# EAGLE design DW08B (EAGLE 6.6.0)
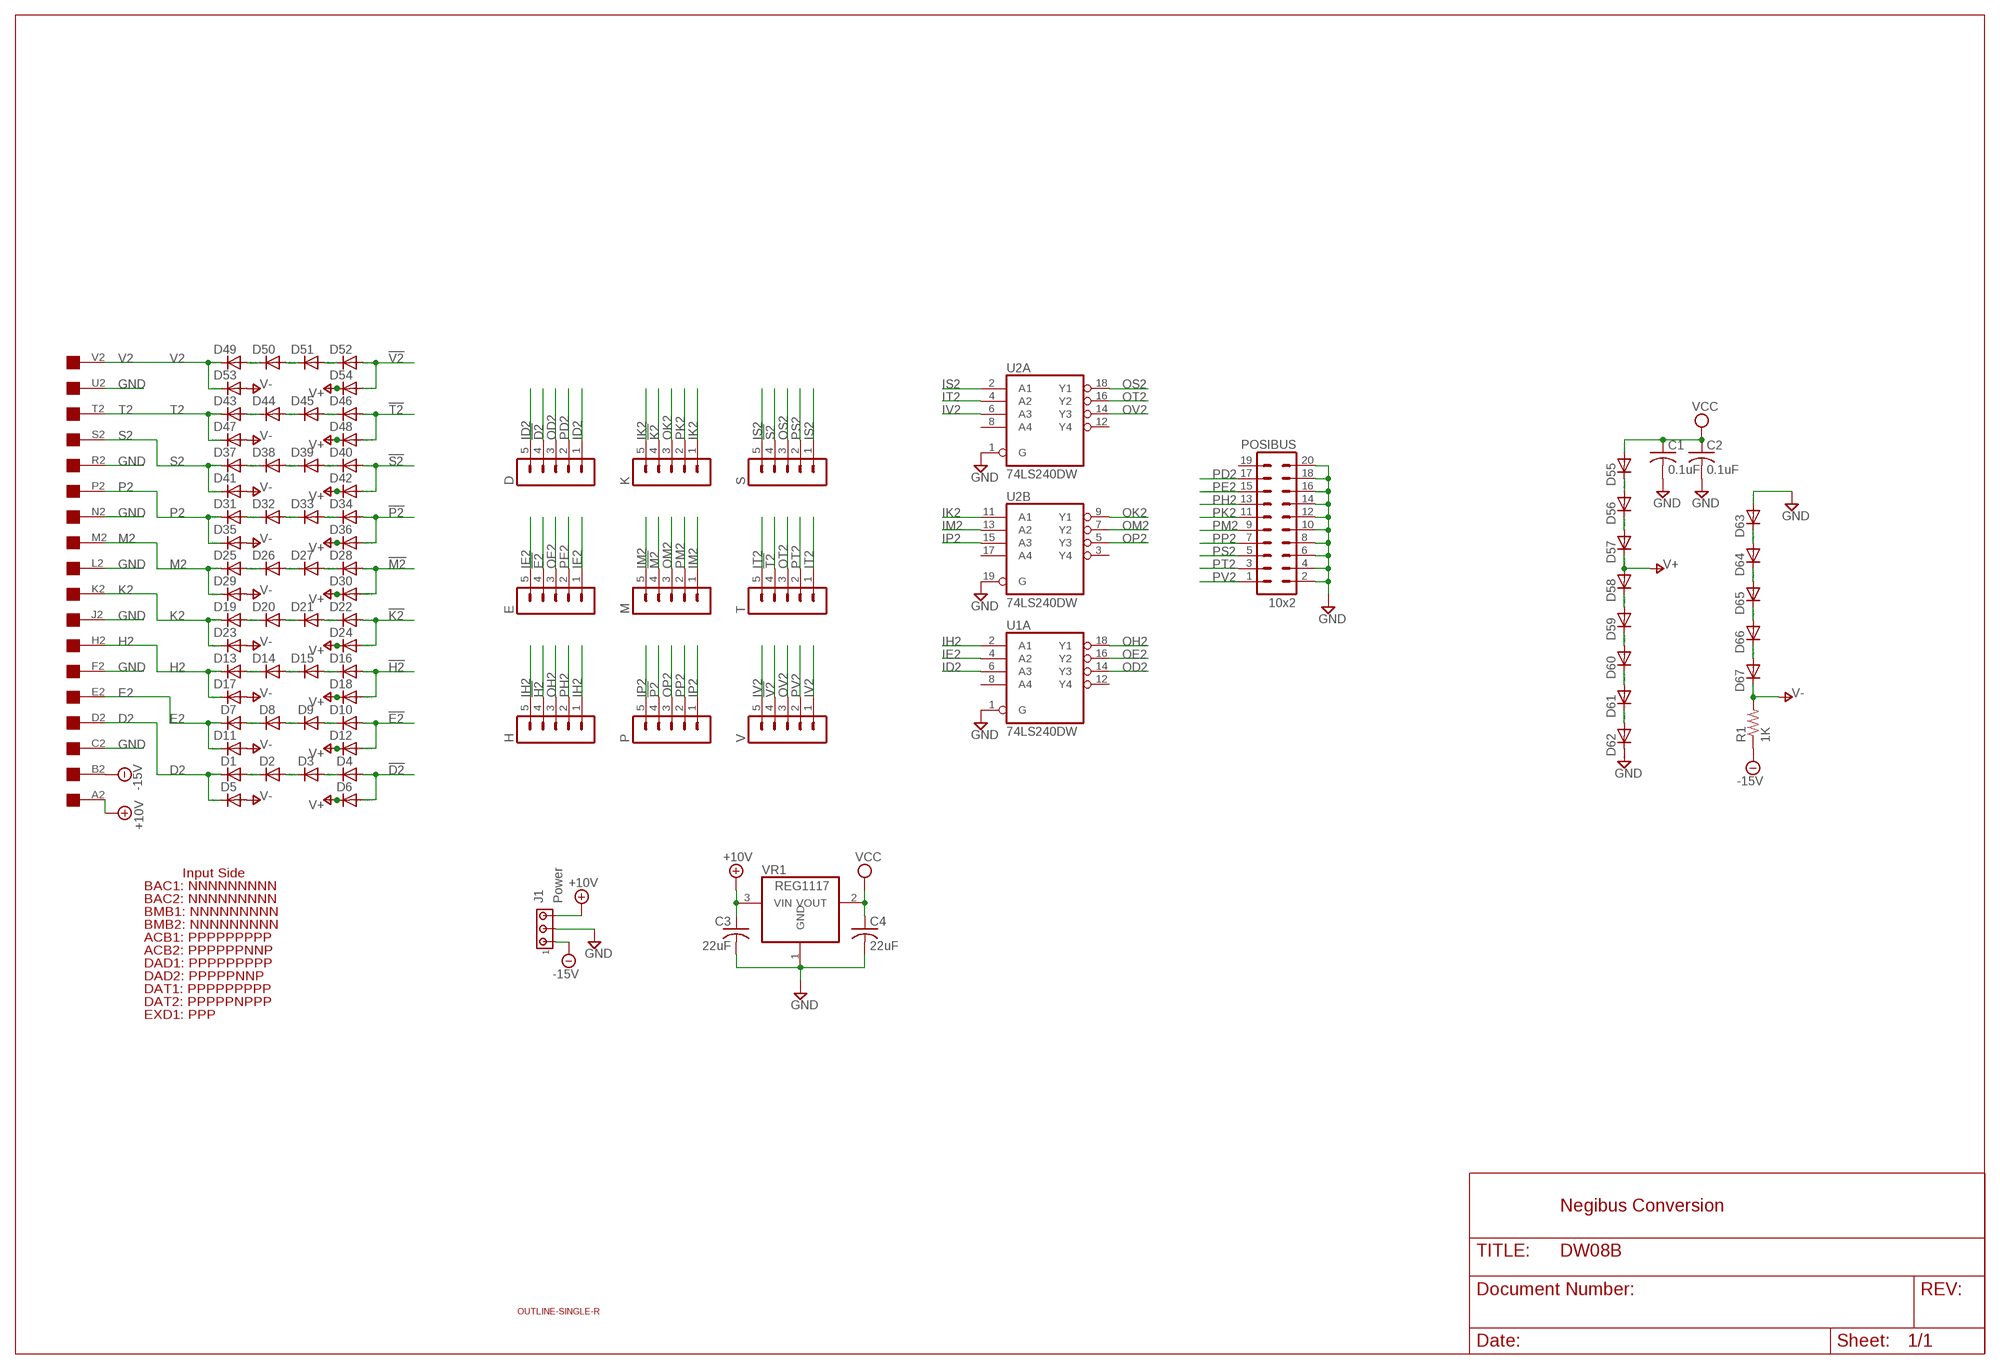
[diagram p0: schematic, sheet 1]

## Parts
C1  0.1uF  C-US050-025X075  [C050-025X075]
C2  0.1uF  C-US050-025X075  [C050-025X075]
C3  22uF  C-USC0805  [C0805]
C4  22uF  C-USC0805  [C0805]
D  MA05-1  [MA05-1]
D1  1N4148WS  DIODE-SOD323-W  [SOD323-W]
D2  1N4148WS  DIODE-SOD323-W  [SOD323-W]
D3  1N4148WS  DIODE-SOD323-W  [SOD323-W]
D4  1N4148WS  DIODE-SOD323-W  [SOD323-W]
D5  1N4148WS  DIODE-SOD323-W  [SOD323-W]
D6  1N4148WS  DIODE-SOD323-W  [SOD323-W]
D7  1N4148WS  DIODE-SOD323-W  [SOD323-W]
D8  1N4148WS  DIODE-SOD323-W  [SOD323-W]
D9  1N4148WS  DIODE-SOD323-W  [SOD323-W]
D10  1N4148WS  DIODE-SOD323-W  [SOD323-W]
D11  1N4148WS  DIODE-SOD323-W  [SOD323-W]
D12  1N4148WS  DIODE-SOD323-W  [SOD323-W]
D13  1N4148WS  DIODE-SOD323-W  [SOD323-W]
D14  1N4148WS  DIODE-SOD323-W  [SOD323-W]
D15  1N4148WS  DIODE-SOD323-W  [SOD323-W]
D16  1N4148WS  DIODE-SOD323-W  [SOD323-W]
D17  1N4148WS  DIODE-SOD323-W  [SOD323-W]
D18  1N4148WS  DIODE-SOD323-W  [SOD323-W]
D19  1N4148WS  DIODE-SOD323-W  [SOD323-W]
D20  1N4148WS  DIODE-SOD323-W  [SOD323-W]
D21  1N4148WS  DIODE-SOD323-W  [SOD323-W]
D22  1N4148WS  DIODE-SOD323-W  [SOD323-W]
D23  1N4148WS  DIODE-SOD323-W  [SOD323-W]
D24  1N4148WS  DIODE-SOD323-W  [SOD323-W]
D25  1N4148WS  DIODE-SOD323-W  [SOD323-W]
D26  1N4148WS  DIODE-SOD323-W  [SOD323-W]
D27  1N4148WS  DIODE-SOD323-W  [SOD323-W]
D28  1N4148WS  DIODE-SOD323-W  [SOD323-W]
D29  1N4148WS  DIODE-SOD323-W  [SOD323-W]
D30  1N4148WS  DIODE-SOD323-W  [SOD323-W]
D31  1N4148WS  DIODE-SOD323-W  [SOD323-W]
D32  1N4148WS  DIODE-SOD323-W  [SOD323-W]
D33  1N4148WS  DIODE-SOD323-W  [SOD323-W]
D34  1N4148WS  DIODE-SOD323-W  [SOD323-W]
D35  1N4148WS  DIODE-SOD323-W  [SOD323-W]
D36  1N4148WS  DIODE-SOD323-W  [SOD323-W]
D37  1N4148WS  DIODE-SOD323-W  [SOD323-W]
D38  1N4148WS  DIODE-SOD323-W  [SOD323-W]
D39  1N4148WS  DIODE-SOD323-W  [SOD323-W]
D40  1N4148WS  DIODE-SOD323-W  [SOD323-W]
D41  1N4148WS  DIODE-SOD323-W  [SOD323-W]
D42  1N4148WS  DIODE-SOD323-W  [SOD323-W]
D43  1N4148WS  DIODE-SOD323-W  [SOD323-W]
D44  1N4148WS  DIODE-SOD323-W  [SOD323-W]
D45  1N4148WS  DIODE-SOD323-W  [SOD323-W]
D46  1N4148WS  DIODE-SOD323-W  [SOD323-W]
D47  1N4148WS  DIODE-SOD323-W  [SOD323-W]
D48  1N4148WS  DIODE-SOD323-W  [SOD323-W]
D49  1N4148WS  DIODE-SOD323-W  [SOD323-W]
D50  1N4148WS  DIODE-SOD323-W  [SOD323-W]
D51  1N4148WS  DIODE-SOD323-W  [SOD323-W]
D52  1N4148WS  DIODE-SOD323-W  [SOD323-W]
D53  1N4148WS  DIODE-SOD323-W  [SOD323-W]
D54  1N4148WS  DIODE-SOD323-W  [SOD323-W]
D55  1N4148WS  DIODE-SOD323-W  [SOD323-W]
D56  1N4148WS  DIODE-SOD323-W  [SOD323-W]
D57  1N4148WS  DIODE-SOD323-W  [SOD323-W]
D58  1N4148WS  DIODE-SOD323-W  [SOD323-W]
D59  1N4148WS  DIODE-SOD323-W  [SOD323-W]
D60  1N4148WS  DIODE-SOD323-W  [SOD323-W]
D61  1N4148WS  DIODE-SOD323-W  [SOD323-W]
D62  1N4148WS  DIODE-SOD323-W  [SOD323-W]
D63  1N4148WS  DIODE-SOD323-W  [SOD323-W]
D64  1N4148WS  DIODE-SOD323-W  [SOD323-W]
D65  1N4148WS  DIODE-SOD323-W  [SOD323-W]
D66  1N4148WS  DIODE-SOD323-W  [SOD323-W]
D67  1N4148WS  DIODE-SOD323-W  [SOD323-W]
E  MA05-1  [MA05-1]
H  MA05-1  [MA05-1]
J1  Power  MTA03-100  [10X03MTA]
K  MA05-1  [MA05-1]
M  MA05-1  [MA05-1]
P  MA05-1  [MA05-1]
POSIBUS  10x2  MA10-2  [MA10-2]
R1  1K  R-US_0207/10  [0207/10]
S  MA05-1  [MA05-1]
T  MA05-1  [MA05-1]
U1  74LS240DW  [SO20W]
U2  74LS240DW  [SO20W]
U$1  OUTLINE-SINGLE-R  [SINGLE-R]
U$2  EDGE  SINGLE  [EDGE-CON2]
V  MA05-1  [MA05-1]
VR1  REG1117  [SOT223]

## Nets
!D2: D4.A D6.A D.4
!E2: D10.A D12.A E.4
!H2: D16.A D18.A H.4
!K2: D22.A D24.A K.4
!M2: D28.A D30.A M.4
!P2: D34.A D36.A P.4
!S2: D40.A D42.A S.4
!T2: D46.A D48.A T.4
!V2: D52.A D54.A V.4
+10V: C3.1 J1.3 U$2.A2 VR1.3(VIN)
-15V: J1.1 R1.1 U$2.B2
D2: D1.C D5.C U$2.D2
E2: D7.C D11.C U$2.E2
GND [Ground]: C1.2 C2.2 C3.2 C4.2 D62.C D63.A J1.2 POSIBUS.2 POSIBUS.4 POSIBUS.6 POSIBUS.8 POSIBUS.10 POSIBUS.12 POSIBUS.14 POSIBUS.16 POSIBUS.18 POSIBUS.20 U1.1(A:G) U2.1(A:G) U2.19(B:G) U$2.C2 U$2.F2 U$2.J2 U$2.L2 U$2.N2 U$2.R2 U$2.U2 VR1.1(GND)
H2: D13.C D17.C U$2.H2
ID2: D.1 D.5 U1.6(A:A3)
IE2: E.1 E.5 U1.4(A:A2)
IH2: H.1 H.5 U1.2(A:A1)
IK2: K.1 K.5 U2.11(B:A1)
IM2: M.1 M.5 U2.13(B:A2)
IP2: P.1 P.5 U2.15(B:A3)
IS2: S.1 S.5 U2.2(A:A1)
IT2: T.1 T.5 U2.4(A:A2)
IV2: U2.6(A:A3) V.1 V.5
K2: D19.C D23.C U$2.K2
M2: D25.C D29.C U$2.M2
N$1: D13.A D14.C
N$2: D1.A D2.C
N$3: D2.A D3.C
N$4: D3.A D4.C
N$5: D14.A D15.C
N$6: D15.A D16.C
N$7: D7.A D8.C
N$8: D8.A D9.C
N$9: D9.A D10.C
N$10: D19.A D20.C
N$11: D20.A D21.C
N$12: D21.A D22.C
N$13: D25.A D26.C
N$14: D26.A D27.C
N$15: D27.A D28.C
N$16: D31.A D32.C
N$17: D32.A D33.C
N$18: D33.A D34.C
N$19: D37.A D38.C
N$20: D38.A D39.C
N$21: D39.A D40.C
N$22: D43.A D44.C
N$23: D44.A D45.C
N$24: D45.A D46.C
N$25: D49.A D50.C
N$26: D50.A D51.C
N$27: D51.A D52.C
N$28: D55.C D56.A
N$29: D56.C D57.A
N$30: D65.C D66.A
N$31: D58.C D59.A
N$32: D59.C D60.A
N$33: D60.C D61.A
N$34: D63.C D64.A
N$35: D64.C D65.A
N$36 [Ground]: D61.C D62.A
N$37: D66.C D67.A
OD2: D.3 U1.14(A:Y3)
OE2: E.3 U1.16(A:Y2)
OH2: H.3 U1.18(A:Y1)
OK2: K.3 U2.9(B:Y1)
OM2: M.3 U2.7(B:Y2)
OP2: P.3 U2.5(B:Y3)
OS2: S.3 U2.18(A:Y1)
OT2: T.3 U2.16(A:Y2)
OV2: U2.14(A:Y3) V.3
P2: D31.C D35.C U$2.P2
PD2: D.2 POSIBUS.17
PE2: E.2 POSIBUS.15
PH2: H.2 POSIBUS.13
PK2: K.2 POSIBUS.11
PM2: M.2 POSIBUS.9
PP2: P.2 POSIBUS.7
PS2: POSIBUS.5 S.2
PT2: POSIBUS.3 T.2
PV2: POSIBUS.1 V.2
S2: D37.C D41.C U$2.S2
T2: D43.C D47.C U$2.T2
V2: D49.C D53.C U$2.V2
V+: D6.C D12.C D18.C D24.C D30.C D36.C D42.C D48.C D54.C D57.C D58.A
V-: D5.A D11.A D17.A D23.A D29.A D35.A D41.A D47.A D53.A D67.C R1.2
VCC: C1.1 C2.1 C4.1 D55.A VR1.2(VOUT)
Unconnected: POSIBUS.19 U1.3(B:Y4) U1.5(B:Y3) U1.7(B:Y2) U1.8(A:A4) U1.9(B:Y1) U1.11(B:A1) U1.12(A:Y4) U1.13(B:A2) U1.15(B:A3) U1.17(B:A4) U1.19(B:G) U2.3(B:Y4) U2.8(A:A4) U2.12(A:Y4) U2.17(B:A4) U$2.A1 U$2.B1 U$2.C1 U$2.D1 U$2.E1 U$2.F1 U$2.H1 U$2.J1 U$2.K1 U$2.L1 U$2.M1 U$2.N1 U$2.P1 U$2.R1 U$2.S1 U$2.T1 U$2.U1 U$2.V1

## Notes on the sheet
- Input Side
- BAC1: NNNNNNNNN
- BAC2: NNNNNNNNN
- BMB1: NNNNNNNNN
- BMB2: NNNNNNNNN
- ACB1: PPPPPPPPP
- ACB2: PPPPPPNNP
- DAD1: PPPPPPPPP
- DAD2: PPPPPNNP
- DAT1: PPPPPPPPP
- DAT2: PPPPPNPPP
- EXD1: PPP
- Negibus Conversion

## Power pins joined to a net without a drawn wire
GND: U1.10(P:GND) U2.10(P:GND)
VCC: U1.20(P:VCC) U2.20(P:VCC)

## Library data of the parts
C1-C4 = rcl:C-US: CAPACITOR, American symbol
D E H K M P S T V = con-lstb:MA05-1: PIN HEADER; OC_FARNELL: unknown; OC_NEWARK: unknown
D1-D67 = diode:DIODE-: DIODE
J1 = con-amp:MTA03-100: AMP connector
POSIBUS = con-lstb:MA10-2: PIN HEADER; OC_FARNELL: unknown; OC_NEWARK: unknown
R1 = rcl:R-US_: RESISTOR, American symbol
U1 U2 = 74xx-us:74*240: Octal BUFFER and LINE DRIVER, 3-state
U$1 = dec-con:OUTLINE-*: Board outlines for DEC boards.
U$2 = dec-con:SINGLE: Single-Height DEC board
VR1 = burr-brown:REG1117: 800mA and 1A Low Dropout (LDO) Positive Regulator 1.8V, 2.5V, 2.85V, 3.3V, 5V, and Adj; MPN: REG1117; OC_FARNELL: 1097566; OC_NEWARK: 14P6981

## Board
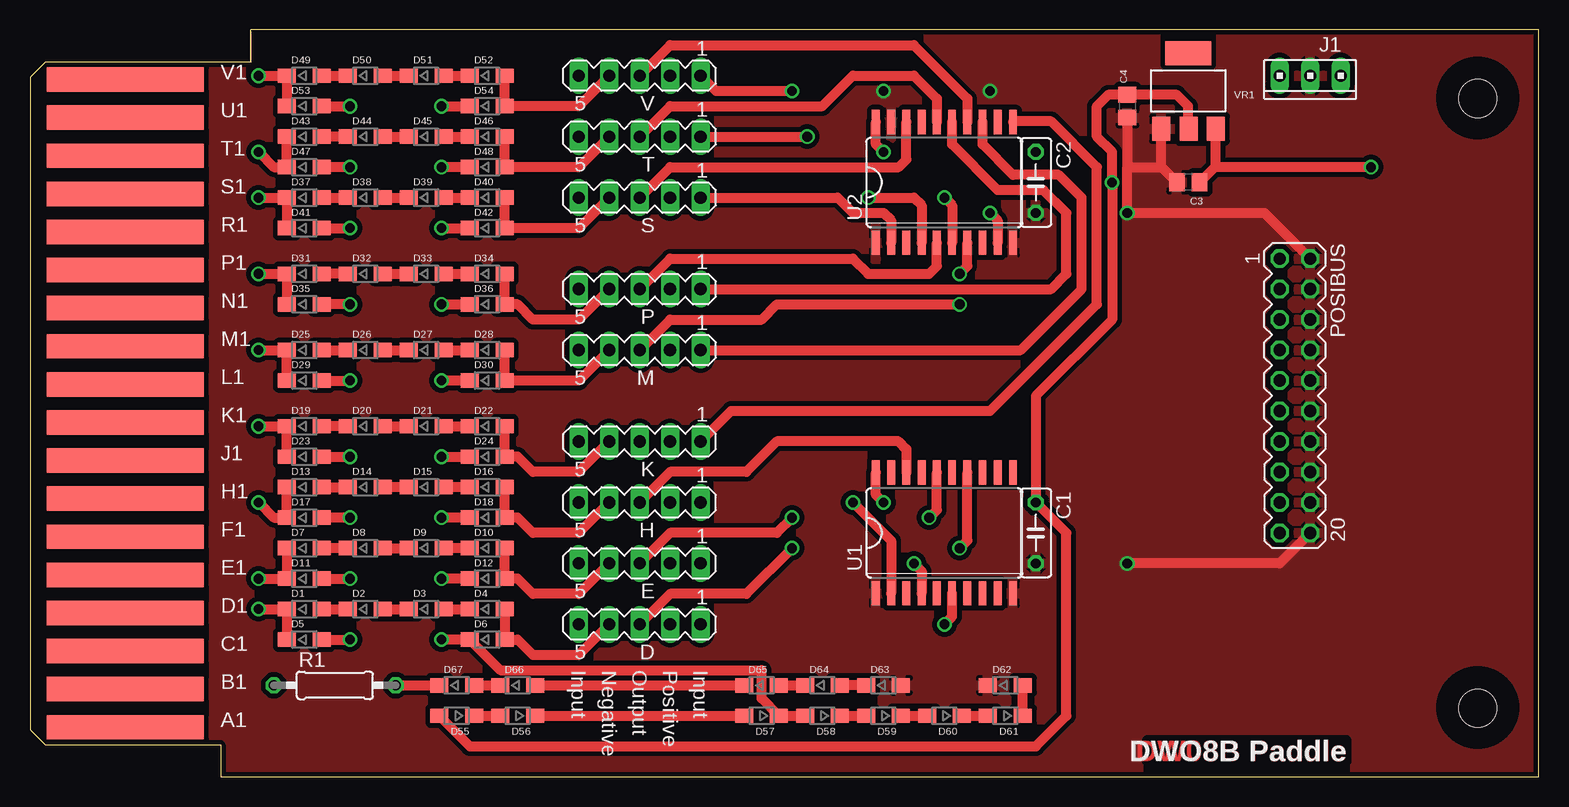
[diagram p1: board, top side]
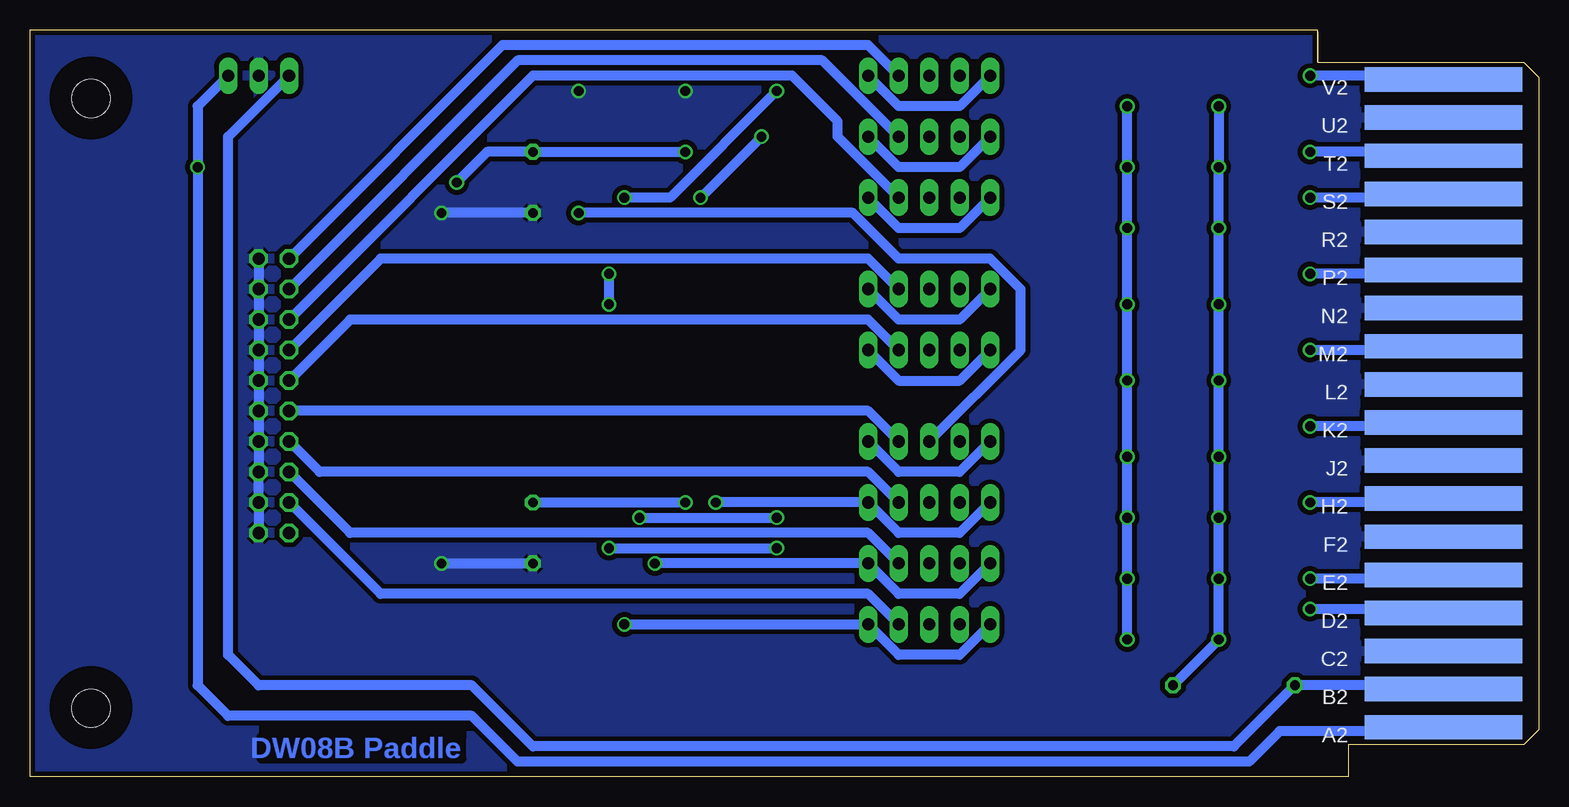
[diagram p2: board, bottom side, seen from below]

Size 125.73 x 62.23 mm. Coordinates in mm from the lower left corner, seen from the top.
Copper layers (1+16): Top 0.035mm / dielectric 1.5mm / Bottom 0.035mm
Design rules "16mils": minimum track width 16mil, minimum drill 32mil, track to track 15mil, track to pad 10mil, pad to pad 10mil, via to via 10mil, smd to smd 10mil, copper to edge 13mil, drill to drill 10mil, minimum pad ring 10mil, minimum via ring 8mil, stop-mask expansion 0mil, vias tented up to drill 0mil, thermal gap 10mil
tRestrict: area 117.8,53.7 to 123.5,59.4; area 117.8,2.9 to 123.5,8.6
bRestrict: area 117.8,53.7 to 123.5,59.4; area 117.8,2.9 to 123.5,8.6; area 117.8,53.7 to 123.5,59.4

### Footprints (pad centres in the part's own frame; a part is rotated, then mirrored left to right if it is on the bottom)
C050-025X075 = drill 0.813 octagon: 1 -2.54,0; 2 2.54,0
C0805 = smd 1.3 x 1.5: 1 -0.95,0; 2 0.95,0
MA05-1 = drill 1.016 long: 1 -5.08,0; 2 -2.54,0; 3 0,0; 4 2.54,0; 5 5.08,0
SOD323-W = smd 1.5 x 1.2: A 1.45,0; C -1.45,0
10X03MTA = drill 1.016 long: 1 2.54,0; 2 0,0; 3 -2.54,0
MA10-2 = drill 1.016 octagon: 1 -11.43,-1.27; 2 -11.43,1.27; 3 -8.89,-1.27; 4 -8.89,1.27; 5 -6.35,-1.27; 6 -6.35,1.27; 7 -3.81,-1.27; 8 -3.81,1.27; 9 -1.27,-1.27; 10 -1.27,1.27; 11 1.27,-1.27; 12 1.27,1.27; 13 3.81,-1.27; 14 3.81,1.27; 15 6.35,-1.27; 16 6.35,1.27; 17 8.89,-1.27; 18 8.89,1.27; 19 11.43,-1.27; 20 11.43,1.27
0207/10 = drill 0.813 octagon: 1 -5.08,0; 2 5.08,0
SO20W = smd 0.66 x 2.032: 1 -5.715,-5.029; 2 -4.445,-5.029; 3 -3.175,-5.029; 4 -1.905,-5.029; 5 -0.635,-5.029; 6 0.635,-5.029; 7 1.905,-5.029; 8 3.175,-5.029; 9 4.445,-5.029; 10 5.715,-5.029; 11 5.715,5.029; 12 4.445,5.029; 13 3.175,5.029; 14 1.905,5.029; 15 0.635,5.029; 16 -0.635,5.029; 17 -1.905,5.029; 18 -3.175,5.029; 19 -4.445,5.029; 20 -5.715,5.029
SINGLE-R = hole 3.175: 5.08,5.715; 5.08,56.515
EDGE-CON2 = smd 13.106 x 2.032: A1 7.938,4.128; B1 7.938,7.303; C1 7.938,10.477; D1 7.938,13.652; E1 7.938,16.828; F1 7.938,20.003; H1 7.938,23.177; J1 7.938,26.352; K1 7.938,29.527; L1 7.938,32.703; M1 7.938,35.877; N1 7.938,39.053; P1 7.938,42.227; R1 7.938,45.403; S1 7.938,48.578; T1 7.938,51.752; U1 7.938,54.928; V1 7.938,58.102 | smd 13.106 x 2.032 bottom: A2 7.938,4.128; B2 7.938,7.303; C2 7.938,10.477; D2 7.938,13.652; E2 7.938,16.828; F2 7.938,20.003; H2 7.938,23.177; J2 7.938,26.352; K2 7.938,29.527; L2 7.938,32.703; M2 7.938,35.877; N2 7.938,39.053; P2 7.938,42.227; R2 7.938,45.403; S2 7.938,48.578; T2 7.938,51.752; U2 7.938,54.928; V2 7.938,58.102
SOT223 = smd 1.499 x 2.007: 1 -2.261,-3.15; 2 0.025,-3.15; 3 2.311,-3.15 | smd 3.81 x 2.007: 4 0,3.15

### Placement (x,y rotation side)
C1  83.82,20.32 270 top
C2  83.82,49.53 270 top
C3  96.52,49.53 180 top
C4  91.44,55.88 270 top
D  50.8,12.7 180 top
D1  22.86,13.97 0 top
D2  27.94,13.97 0 top
D3  33.02,13.97 0 top
D4  38.1,13.97 0 top
D5  22.86,11.43 0 top
D6  38.1,11.43 0 top
D7  22.86,19.05 0 top
D8  27.94,19.05 0 top
D9  33.02,19.05 0 top
D10  38.1,19.05 0 top
D11  22.86,16.51 0 top
D12  38.1,16.51 0 top
D13  22.86,24.13 0 top
D14  27.94,24.13 0 top
D15  33.02,24.13 0 top
D16  38.1,24.13 0 top
D17  22.86,21.59 0 top
D18  38.1,21.59 0 top
D19  22.86,29.21 0 top
D20  27.94,29.21 0 top
D21  33.02,29.21 0 top
D22  38.1,29.21 0 top
D23  22.86,26.67 0 top
D24  38.1,26.67 0 top
D25  22.86,35.56 0 top
D26  27.94,35.56 0 top
D27  33.02,35.56 0 top
D28  38.1,35.56 0 top
D29  22.86,33.02 0 top
D30  38.1,33.02 0 top
D31  22.86,41.91 0 top
D32  27.94,41.91 0 top
D33  33.02,41.91 0 top
D34  38.1,41.91 0 top
D35  22.86,39.37 0 top
D36  38.1,39.37 0 top
D37  22.86,48.26 0 top
D38  27.94,48.26 0 top
D39  33.02,48.26 0 top
D40  38.1,48.26 0 top
D41  22.86,45.72 0 top
D42  38.1,45.72 0 top
D43  22.86,53.34 0 top
D44  27.94,53.34 0 top
D45  33.02,53.34 0 top
D46  38.1,53.34 0 top
D47  22.86,50.8 0 top
D48  38.1,50.8 0 top
D49  22.86,58.42 0 top
D50  27.94,58.42 0 top
D51  33.02,58.42 0 top
D52  38.1,58.42 0 top
D53  22.86,55.88 0 top
D54  38.1,55.88 0 top
D55  35.56,5.08 180 top
D56  40.64,5.08 180 top
D57  60.96,5.08 180 top
D58  66.04,5.08 180 top
D59  71.12,5.08 180 top
D60  76.2,5.08 180 top
D61  81.28,5.08 180 top
D62  81.28,7.62 0 top
D63  71.12,7.62 0 top
D64  66.04,7.62 0 top
D65  60.96,7.62 0 top
D66  40.64,7.62 0 top
D67  35.56,7.62 0 top
E  50.8,17.78 180 top
H  50.8,22.86 180 top
J1  106.68,58.42 180 top
K  50.8,27.94 180 top
M  50.8,35.56 180 top
P  50.8,40.64 180 top
POSIBUS  105.41,31.75 270 top
R1  25.4,7.62 0 top
S  50.8,48.26 180 top
T  50.8,53.34 180 top
U1  76.2,20.32 0 top
U2  76.2,49.53 0 top
U$1  125.73,62.23 180 top
U$2  0,0 0 top
V  50.8,58.42 180 top
VR1  96.52,57.15 0 top

### Tracks (layer width: path | path; a pad name or v marks a point on that pad's centre or on a via)
!D2
  Top 0.813: D4.A D6.A 40.64,11.43 41.91,10.16 45.72,10.16 D.4
!E2
  Top 0.813: D10.A D12.A 40.64,16.51 41.91,15.24 45.72,15.24 E.4
!H2
  Top 0.813: D16.A D18.A 40.64,21.59 41.91,20.32 45.72,20.32 H.4
!K2
  Top 0.813: D22.A D24.A 40.64,26.67 41.91,25.4 45.72,25.4 K.4
!M2
  Top 0.813: D28.A D30.A 45.72,33.02 M.4
!P2
  Top 0.813: D34.A D36.A 40.64,39.37 41.91,38.1 45.72,38.1 P.4
!S2
  Top 0.813: D40.A D42.A 45.72,45.72 S.4
!T2
  Top 0.813: D46.A D48.A 45.72,50.8 T.4
!V2
  Top 0.813: D52.A D54.A 45.72,55.88 V.4
+10V  (via drill 0.81)
  Top 0.813: C3.1 98.83,50.89 | 98.83,50.89 VR1.3 | v111.76,50.8 99.06,50.8 98.97,50.89 98.83,50.89
  Bottom 0.813: U$2.A2 8.26,3.81 21.59,3.81 24.13,1.27 85.09,1.27 88.9,5.08 109.22,5.08 111.76,7.62 v111.76,50.8 111.76,55.88 J1.3
-15V
  Bottom 0.813: U$2.B2 8.26,7.62 R1.1 25.4,2.54 83.82,2.54 88.9,7.62 106.68,7.62 109.22,10.16 109.22,53.34 J1.1
D2  (via drill 0.81)
  Top 0.813: v19.05,13.97 D1.C D5.C
  Bottom 0.813: U$2.D2 8.26,13.97 v19.05,13.97
E2  (via drill 0.81)
  Top 0.813: D7.C D11.C v19.05,16.51
  Bottom 0.813: U$2.E2 8.26,16.51 v19.05,16.51
GND  (via drill 0.81)
  Top 0.813: POSIBUS.2 102.87,46.99 v91.44,46.99 91.44,50.8 | POSIBUS.20 104.14,17.78 v91.44,17.78 | C3.2 94.26,50.84 | 94.26,50.84 VR1.1 | C4.2 91.44,50.8 | 91.44,50.8 94.22,50.8 94.26,50.84
  Bottom 0.813: POSIBUS.2 POSIBUS.4 POSIBUS.6 POSIBUS.8 POSIBUS.10 POSIBUS.12 POSIBUS.14 POSIBUS.16 POSIBUS.18 POSIBUS.20 | C2.2 v91.44,46.99 | v91.44,17.78 C1.2
  other vias: 71.12,57.15 80.01,57.15
  pour Top (isolate 0.406): 125.73,62.23 13.97,62.23 13.97,0 125.73,0
  pour Bottom (isolate 0.406): 125.73,62.23 13.97,62.23 13.97,0 125.73,0
H2  (via drill 0.81)
  Top 0.813: v19.05,22.86 20.32,21.59 D17.C D13.C
  Bottom 0.813: U$2.H2 8.26,22.86 v19.05,22.86
ID2  (via drill 0.81)
  Top 0.813: v76.2,12.7 76.84,13.34 U1.6
  Bottom 0.813: D.5 48.26,10.16 53.34,10.16 D.1 v76.2,12.7
IE2  (via drill 0.81)
  Top 0.813: v73.66,17.78 74.3,17.14 U1.4
  Bottom 0.813: E.5 48.26,15.24 53.34,15.24 E.1 v73.66,17.78
IH2  (via drill 0.81)
  Top 0.813: v68.58,22.86 71.76,19.68 U1.2
  Bottom 0.813: H.5 48.26,20.32 53.34,20.32 H.1 v68.58,22.86
IK2
  Top 0.813: K.1 58.42,30.48 80.01,30.48 88.9,39.37 88.9,50.8 85.09,54.61 81.97,54.61 U2.11
  Bottom 0.813: K.5 48.26,25.4 53.34,25.4 K.1
IM2
  Top 0.813: M.1 82.55,35.56 87.63,40.64 87.63,48.26 85.73,50.16 81.92,50.16 79.38,52.7 U2.13
  Bottom 0.813: M.1 53.34,33.02 48.26,33.02 M.5
IP2
  Top 0.813: P.1 85.09,40.64 86.36,41.91 86.36,46.99 84.46,48.9 80.65,48.9 76.84,52.7 U2.15
  Bottom 0.813: P.5 48.26,38.1 53.34,38.1 P.1
IS2
  Top 0.813: S.1 67.31,48.26 68.58,46.99 71.12,46.99 71.76,46.35 U2.2
  Bottom 0.813: S.5 48.26,45.72 53.34,45.72 S.1
IT2  (via drill 0.81)
  Top 0.813: T.1 v64.77,53.34 | v69.85,48.26 73.66,48.26 74.3,47.62 U2.4
  Bottom 0.813: T.5 48.26,50.8 53.34,50.8 T.1 | v64.77,53.34 v69.85,48.26
IV2  (via drill 0.81)
  Top 0.813: V.1 57.15,57.15 v63.5,57.15 | v76.2,48.26 76.84,47.62 U2.6
  Bottom 0.813: V.5 48.26,55.88 53.34,55.88 V.1 | v63.5,57.15 72.39,48.26 v76.2,48.26
K2  (via drill 0.81)
  Top 0.813: D23.C D19.C v19.05,29.21
  Bottom 0.813: U$2.K2 8.26,29.21 v19.05,29.21
M2  (via drill 0.81)
  Top 0.813: v19.05,35.56 D25.C D29.C
  Bottom 0.813: U$2.M2 8.26,35.56 v19.05,35.56
N$1
  Top 0.813: D13.A D14.C
N$2
  Top 0.813: D1.A D2.C
N$3
  Top 0.813: D2.A D3.C
N$4
  Top 0.813: D3.A D4.C
N$5
  Top 0.813: D15.C D14.A
N$6
  Top 0.813: D16.C D15.A
N$7
  Top 0.813: D8.C D7.A
N$8
  Top 0.813: D8.A D9.C
N$9
  Top 0.813: D10.C D9.A
N$10
  Top 0.813: D20.C D19.A
N$11
  Top 0.813: D20.A D21.C
N$12
  Top 0.813: D21.A D22.C
N$13
  Top 0.813: D25.A D26.C
N$14
  Top 0.813: D26.A D27.C
N$15
  Top 0.813: D27.A D28.C
N$16
  Top 0.813: D32.C D31.A
N$17
  Top 0.813: D32.A D33.C
N$18
  Top 0.813: D33.A D34.C
N$19
  Top 0.813: D37.A D38.C
N$20
  Top 0.813: D38.A D39.C
N$21
  Top 0.813: D39.A D40.C
N$22
  Top 0.813: D44.C D43.A
N$23
  Top 0.813: D44.A D45.C
N$24
  Top 0.813: D45.A D46.C
N$25
  Top 0.813: D49.A D50.C
N$26
  Top 0.813: D50.A D51.C
N$27
  Top 0.813: D51.A D52.C
N$28
  Top 0.813: D55.C D56.A
N$29
  Top 0.813: D56.C D57.A
N$30
  Top 0.813: D66.A D65.C
N$31
  Top 0.813: D58.C D59.A
N$32
  Top 0.813: D59.C D60.A
N$33
  Top 0.813: D60.C D61.A
N$34
  Top 0.813: D63.C D64.A
N$35
  Top 0.813: D65.A D64.C
N$36
  Top 0.813: D61.C D62.A
N$37
  Top 0.813: D67.A D66.C
OD2  (via drill 0.81)
  Top 0.813: v63.5,19.05 59.69,15.24 53.34,15.24 D.3 | v77.47,19.05 78.11,19.68 U1.14
  Bottom 0.813: v77.47,19.05 v63.5,19.05
OE2  (via drill 0.81)
  Top 0.813: v63.5,21.59 62.23,20.32 53.34,20.32 E.3 | v74.93,21.59 75.57,22.23 U1.16
  Bottom 0.813: v74.93,21.59 v63.5,21.59
OH2
  Top 0.813: H.3 53.34,25.4 59.69,25.4 62.23,27.94 72.39,27.94 73.03,27.3 U1.18
OK2  (via drill 0.81)
  Top 0.813: v80.01,46.99 80.65,46.35 U2.9
  Bottom 0.813: K.3 43.18,35.56 43.18,40.64 45.72,43.18 53.34,43.18 57.15,46.99 v80.01,46.99
OM2  (via drill 0.81)
  Top 0.813: M.3 53.34,38.1 60.96,38.1 62.23,39.37 v77.47,39.37 | v77.47,41.91 78.11,42.55 U2.7
  Bottom 0.813: v77.47,39.37 v77.47,41.91
OP2
  Top 0.813: P.3 53.34,43.18 68.58,43.18 69.85,41.91 74.93,41.91 75.57,42.55 U2.5
OS2
  Top 0.813: S.3 53.34,50.8 72.39,50.8 73.03,51.44 U2.18
OT2
  Top 0.813: T.3 53.34,55.88 66.04,55.88 68.58,58.42 73.66,58.42 75.57,56.52 U2.16
OV2
  Top 0.813: V.3 53.34,60.96 73.66,60.96 78.11,56.52 U2.14
P2  (via drill 0.81)
  Top 0.813: v19.05,41.91 D31.C D35.C
  Bottom 0.813: U$2.P2 8.26,41.91 v19.05,41.91
PD2
  Bottom 0.813: D.2 55.88,15.24 96.52,15.24 POSIBUS.17
PE2
  Bottom 0.813: E.2 55.88,20.32 99.06,20.32 POSIBUS.15
PH2
  Bottom 0.813: H.2 55.88,25.4 101.6,25.4 POSIBUS.13
PK2
  Bottom 0.813: K.2 55.88,30.48 POSIBUS.11
PM2
  Bottom 0.813: M.2 55.88,38.1 99.06,38.1 POSIBUS.9
PP2
  Bottom 0.813: P.2 55.88,43.18 96.52,43.18 POSIBUS.7
PS2
  Bottom 0.813: S.2 58.42,53.34 58.42,54.61 62.23,58.42 83.82,58.42 POSIBUS.5
PT2
  Bottom 0.813: T.2 59.69,59.69 85.09,59.69 POSIBUS.3
PV2
  Bottom 0.813: V.2 55.88,60.96 86.36,60.96 POSIBUS.1
S2  (via drill 0.81)
  Top 0.813: v19.05,48.26 D37.C D41.C
  Bottom 0.813: U$2.S2 8.26,48.26 v19.05,48.26
T2  (via drill 0.81)
  Top 0.813: v19.05,52.07 20.32,50.8 D47.C D43.C
  Bottom 0.813: U$2.T2 8.26,52.07 v19.05,52.07
V2  (via drill 0.81)
  Top 0.813: v19.05,58.42 D49.C D53.C
  Bottom 0.813: U$2.V2 8.26,58.42 v19.05,58.42
V+  (via drill 0.81)
  Top 0.813: v34.29,11.43 D6.C 39.19,8.89 60.96,8.89 60.96,6.53 D57.C D58.A | v34.29,55.88 D54.C | D48.C v34.29,50.8 | D12.C v34.29,16.51 | D18.C v34.29,21.59 | v34.29,26.67 D24.C | D30.C v34.29,33.02 | v34.29,39.37 D36.C | v34.29,45.72 D42.C
  Bottom 0.813: v34.29,11.43 v34.29,16.51 v34.29,21.59 v34.29,26.67 v34.29,33.02 v34.29,39.37 v34.29,45.72 v34.29,50.8 v34.29,55.88
V-  (via drill 0.81)
  Top 0.813: D53.A v26.67,55.88 | v26.67,50.8 D47.A | D5.A v26.67,11.43 | D41.A v26.67,45.72 | v26.67,39.37 D35.A | D29.A v26.67,33.02 | D11.A v26.67,16.51 | v26.67,21.59 D17.A | D23.A v26.67,26.67 | R1.2 D67.C
  Bottom 0.813: v26.67,55.88 v26.67,50.8 v26.67,45.72 v26.67,39.37 v26.67,33.02 v26.67,26.67 v26.67,21.59 v26.67,16.51 v26.67,11.43 R1.2
VCC  (via drill 0.81)
  Top 0.813: v71.12,22.86 70.49,23.5 U1.20 | D55.A 36.65,2.54 83.82,2.54 86.36,5.08 86.36,20.32 C1.1 83.82,31.75 90.17,38.1 v90.17,49.53 90.17,52.07 88.9,53.34 88.9,55.88 89.85,56.83 C4.1 95.57,56.83 96.52,55.88 96.52,54.03 VR1.2 | v71.12,52.07 70.49,52.7 U2.20
  Bottom 0.813: C1.1 v71.12,22.86 | v71.12,52.07 C2.1 87.63,52.07 v90.17,49.53

### Text on the board
Top: DW08B Paddle
Bottom: DW08B Paddle
tPlace: Input | Negative | Output | Positive | Input | DWO8B Paddle